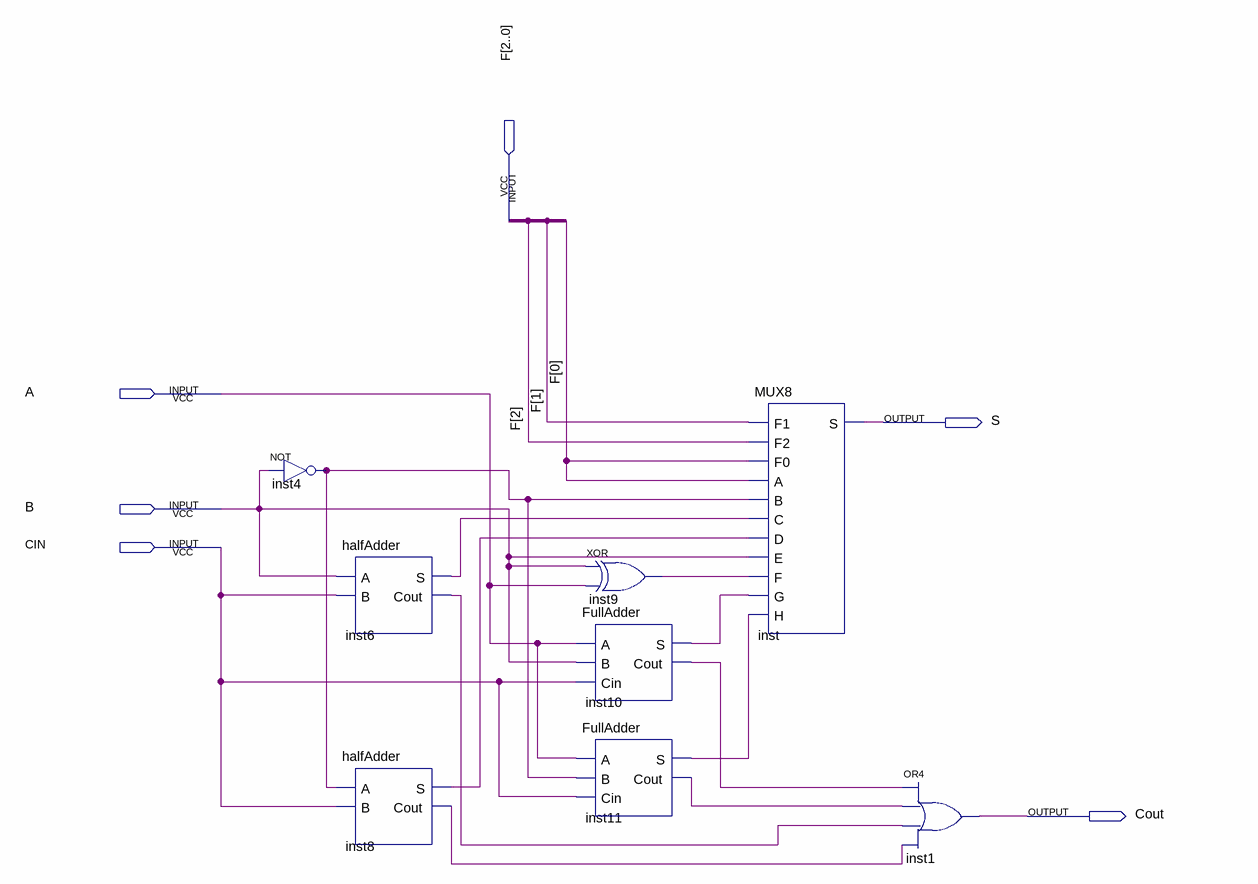
[diagram p0: schematic sheet]
// Quartus schematic ALU.bdf as structural Verilog: 8 symbols, 6 pins
module ALU (
  input  [2:0] F,
  input  A,
  input  B,
  input  CIN,
  output S,
  output Cout
);

  wire inst4_out, inst6_cout, inst6_s, inst8_cout, inst8_s, inst9_out, inst10_cout, inst10_s, inst11_cout,
       inst11_s;

  not inst4 (inst4_out, B);
  halfAdder inst6 (.A(B), .B(CIN), .S(inst6_s), .Cout(inst6_cout));
  halfAdder inst8 (.A(inst4_out), .B(CIN), .S(inst8_s), .Cout(inst8_cout));
  xor inst9 (inst9_out, B, A);
  FullAdder inst10 (.A(A), .B(B), .Cin(CIN), .S(inst10_s), .Cout(inst10_cout));
  FullAdder inst11 (.A(A), .B(inst4_out), .Cin(CIN), .S(inst11_s), .Cout(inst11_cout));
  MUX8 inst (
    .F1(F[1]), .F2(F[2]), .F0(F[0]), .A(F[0]), .B(inst4_out), .C(inst6_s), .D(inst8_s), .E(B), .F(inst9_out),
    .G(inst10_s), .H(inst11_s), .S(S));
  or inst1 (Cout, inst10_cout, inst11_cout, inst6_cout, inst8_cout);
endmodule
